# Altium schematic sheet SH3 - SENSORS.SchDoc: Sensors
size B; CheckedBy: Lance Bantoto; Author: Aidan Gratton; Engineer: Aidan Gratton; Organization: UW Robotics; Address1: 200 University Avenue; Address2: Waterloo; Address3: Ontario; Address4: Canada N2L 3G6; Revision: 2; SheetNumber: 3; SheetTotal: 6
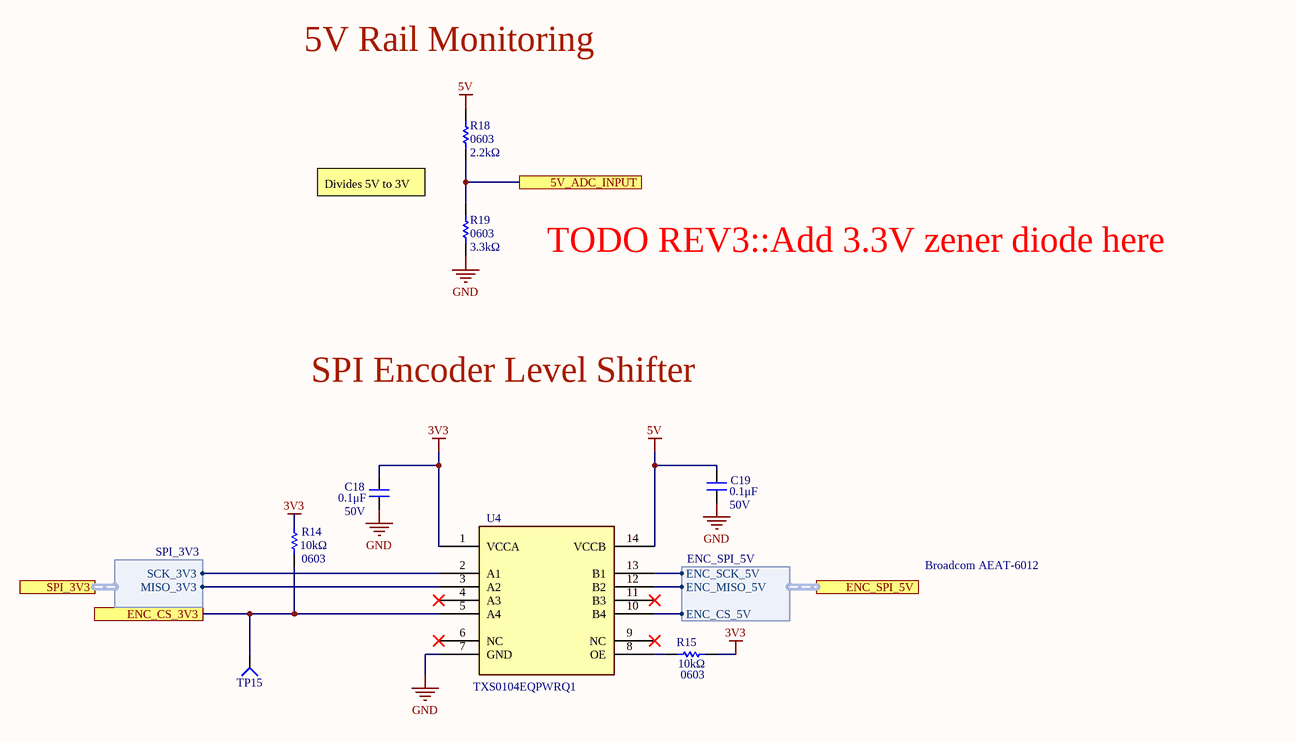
[diagram p0: SH3 - SENSORS.SchDoc]

## Parts
C18  value 0.1μF  Voltage Rating: 50V  [CAP0603]  (hidden comment: CAP_0.1uF_50V_0603)
C19  value 0.1μF  Voltage Rating: 50V  [CAP0603]  (hidden comment: CAP_0.1uF_50V_0603)
R14  value 10kΩ  Case Code (Imperial): 0603  [RESC0603(1608)_N]  (hidden comment: RES_10kΩ_0603)
R15  value 10kΩ  Case Code (Imperial): 0603  [RESC0603(1608)_N]  (hidden comment: RES_10kΩ_0603)
R18  value 2.2kΩ  Case Code (Imperial): 0603  [RESC0603(1608)_N]  (hidden comment: RES_2.2kΩ_0603)
R19  value 3.3kΩ  Case Code (Imperial): 0603  [RESC0603(1608)_N]  (hidden comment: RES_3.3kΩ_0603)
TP15  TESTPOINT_1MM_CIRCLE  [TESTPOINT_CIRCLE_1MM]  (value not drawn)  (no BOM)
U4  TXS0104EQPWRQ1  [TXS0104EQPWRQ1]

## Ports
5V_ADC_INPUT, ENC_CS_3V3, ENC_SPI_5V (harness ENC_SPI_5V), SPI_3V3 (harness SPI_3V3)

## Harnesses
SPI_3V3: MISO_3V3, SCK_3V3
ENC_SPI_5V: ENC_MISO_5V, ENC_CS_5V, ENC_SCK_5V

## Nets
3V3: C18.2 R14.2 R15.2 U4.1(VCCA)
5V: C19.2 R18.2 U4.14(VCCB)
GND: C18.1 C19.1 R19.1 U4.7(GND)
5V_ADC_INPUT: R18.1 R19.2 ; port 5V_ADC_INPUT
ENC_CS_3V3: R14.1 TP15.1(=value) U4.5(A4) ; port ENC_CS_3V3
NetR15_1: R15.1 U4.8(OE)
NetU4_2: U4.2(A1) ; port SPI_3V3.SCK_3V3
NetU4_3: U4.3(A2) ; port SPI_3V3.MISO_3V3
NetU4_10: U4.10(B4) ; port ENC_SPI_5V.ENC_CS_5V
NetU4_12: U4.12(B2) ; port ENC_SPI_5V.ENC_MISO_5V
NetU4_13: U4.13(B1) ; port ENC_SPI_5V.ENC_SCK_5V

Not connected (* = marked no-connect by the designer): U4 4(A3)* 6(NC)* 9(NC)* 11(B3)*

## Notes on the sheet
- 5V Rail Monitoring
- Divides 5V to 3V
- TODO REV3::Add 3.3V zener diode here
- SPI Encoder Level Shifter
- Broadcom AEAT-6012
- Title:
- Project:
- Date:
- Rev:
- Checker:
- Engineer:
- Sheet:
- of

## Library data of the parts
C18 C19 = CAP_0.1uF_50V_0603: CAP CER 0.1UF 50V X7R 0603; Manufacturer Part Number 1: CC0603KRX7R9BB104; Manufacturer 1: Yageo; Dimensions: 0.063" L x 0.031" W (1.60mm x 0.80mm); Package: 0603 (1608 Metric); Temperature Coefficient: X7R; Supplier Part Number 1: 311-1344-1-ND; Supplier 1: Digi-Key; Mount: Surface Mount; Case Code (Imperial): 0603; Case Code (Metric): 1608; Dielectric: X7R
R14 R15 = RES_10kΩ_0603_5%: RES 10K OHM 5% 1/10W 0603; Manufacturer Part Number 1: RC0603JR-0710KL; Manufacturer 1: Yageo; Package: 0603 (1608 Metric); Dimensions: 0.063" L x 0.031" W (1.60mm x 0.80mm); Tolerance: 5%; Supplier Part Number 1: 311-10KGRCT-ND; Supplier 1: Digi-Key; Mount: Surface Mount; Case Code (Metric): 1608
R18 = RES_2.2kΩ_0603_1%: RES 2.2K OHM 1% 1/10W 0603; Manufacturer 1: Yageo; Manufacturer Part Number 1: RC0603FR-072K2L; Dimensions: 0.063" L x 0.031" W (1.60mm x 0.80mm); Package: 0603 (1608 Metric); Supplier Part Number 1: 311-2.20KHRCT-ND; Supplier 1: Digi-Key; Mount: Surface Mount; Case Code (Metric): 1608; Tolerance: 1%
R19 = RES_3.3kΩ_0603_5%: RES 3.3K OHM 5% 1/10W 0603; Manufacturer 1: Yageo; Manufacturer Part Number 1: RC0603JR-073K3L; Dimensions: 0.063" L x 0.031" W (1.60mm x 0.80mm); Package: 0603 (1608 Metric); Supplier 1: Digi-Key; Supplier Part Number 1: 311-3.3KGRCT-ND; Mount: Surface Mount; Case Code (Metric): 1608; Tolerance: 5%
TP15 = TESTPOINT_1MM_CIRCLE: TESTPOINT 1MM CIRCLE; Part Number (MPN): *
U4 = IC_LVL_SHIFTER_4_CH: IC BIDIRECTIONAL LEVEL SHIFTER 4 CHANNEL 14TSSOP; Manufacturer: Texas Instruments; VCCB Max: 5V5 MAX; VCCA Max: 3V6 MAX; Data Rate: 24Mbps; VCCA Voltage: 1.65 V ~ 3.6 V; VCCB Voltage: 2.3 V ~ 5.5 V; Supplier 1: Digi-Key; Supplier Part Number 1: 296-41034-1-ND; Package: 14-TSSOP; MPN: TXS0104EQPWRQ1; Mount: Surface Mount; Min Operating Temperature: -40°C; Max Operating Temperature: 125°C